# Altium schematic sheet Sheet2.SchDoc
size A4
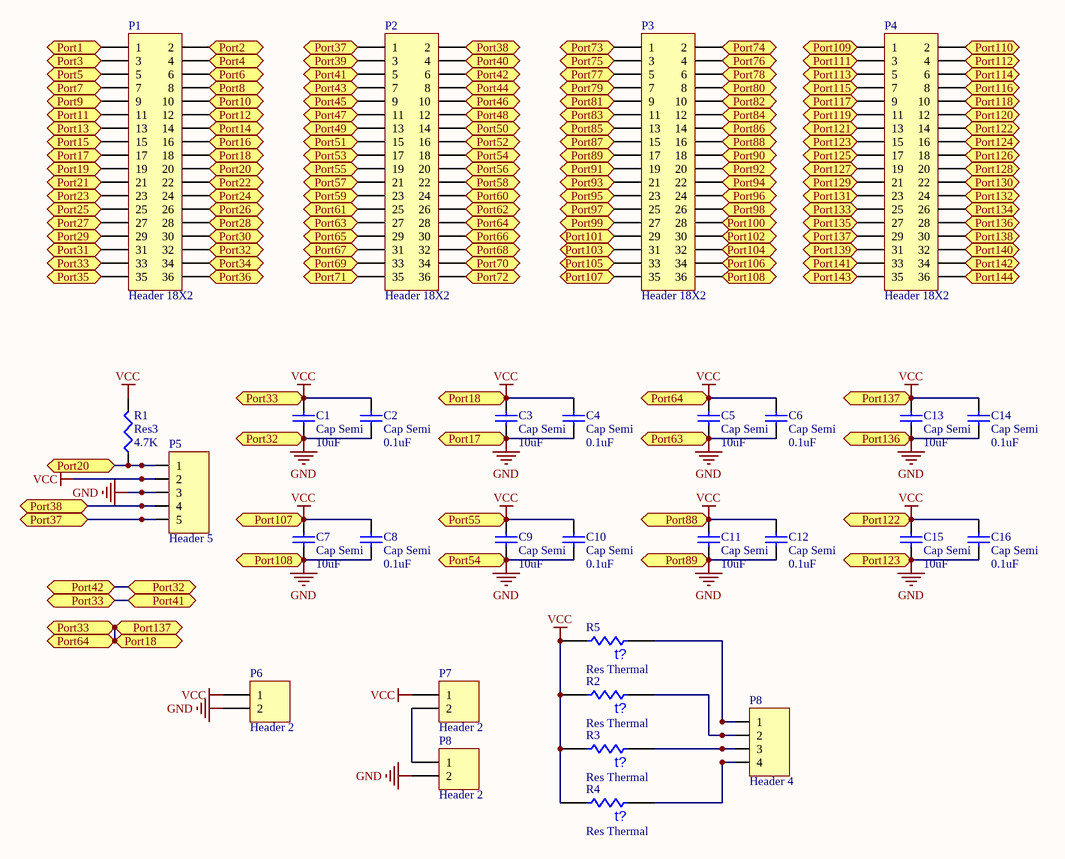
[diagram p0: Sheet2.SchDoc]

## Parts
(Parts that share a designator on the sheet are numbered #1, #2 ... from top to bottom, then left to right.)
C1  Cap Semi  value 10uF  [1608[0603]]
C2  Cap Semi  value 0.1uF  [1608[0603]]
C3  Cap Semi  value 10uF  [1608[0603]]
C4  Cap Semi  value 0.1uF  [1608[0603]]
C5  Cap Semi  value 10uF  [1608[0603]]
C6  Cap Semi  value 0.1uF  [1608[0603]]
C7  Cap Semi  value 10uF  [1608[0603]]
C8  Cap Semi  value 0.1uF  [1608[0603]]
C9  Cap Semi  value 10uF  [1608[0603]]
C10  Cap Semi  value 0.1uF  [1608[0603]]
C11  Cap Semi  value 10uF  [1608[0603]]
C12  Cap Semi  value 0.1uF  [1608[0603]]
C13  Cap Semi  value 10uF  [1608[0603]]
C14  Cap Semi  value 0.1uF  [1608[0603]]
C15  Cap Semi  value 10uF  [1608[0603]]
C16  Cap Semi  value 0.1uF  [1608[0603]]
P1  Header 18X2  [HDR2X18]
P2  Header 18X2  [HDR2X18]
P3  Header 18X2  [HDR2X18]
P4  Header 18X2  [HDR2X18]
P5  Header 5  [HDR1X5]
P6  Header 2  [HDR1X2]
P7  Header 2  [HDR1X2]
P8#1  Header 4  [HDR1X4]
P8#2  Header 2  [HDR1X2]
R1  Res3  value 4.7K  [J1-0603]
R2  Res Thermal  [6-0805_N]
R3  Res Thermal  [6-0805_N]
R4  Res Thermal  [6-0805_N]
R5  Res Thermal  [6-0805_N]

## Ports
Port1, Port2, Port3, Port4, Port5, Port6, Port7, Port8, Port9, Port10, Port11, Port12, Port13, Port14, Port15, Port16, Port17, Port18, Port19, Port20, Port21, Port22, Port23, Port24, Port25, Port26, Port27, Port28, Port29, Port30, Port31, Port32, Port33, Port34, Port35, Port36, Port37, Port38, Port39, Port40, Port41, Port42, Port43, Port44, Port45, Port46, Port47, Port48, Port49, Port50, Port51, Port52, Port53, Port54, Port55, Port56, Port57, Port58, Port59, Port60, Port61, Port62, Port63, Port64, Port65, Port66, Port67, Port68, Port69, Port70, Port71, Port72, Port73, Port74, Port75, Port76, Port77, Port78, Port79, Port80, Port81, Port82, Port83, Port84, Port85, Port86, Port87, Port88, Port89, Port90, Port91, Port92, Port93, Port94, Port95, Port96, Port97, Port98, Port99, Port100, Port101, Port102, Port103, Port104, Port105, Port106, Port107, Port108, Port109, Port110, Port111, Port112, Port113, Port114, Port115, Port116, Port117, Port118, Port119, Port120, Port121, Port122, Port123, Port124, Port125, Port126, Port127, Port128, Port129, Port130, Port131, Port132, Port133, Port134, Port135, Port136, Port137, Port138, Port139, Port140, Port141, Port142, Port143, Port144

## Nets
GND: C1.1 C2.1 C3.1 C4.1 C5.1 C6.1 C7.1 C8.1 C9.1 C10.1 C11.1 C12.1 C13.1 C14.1 C15.1 C16.1 P1.17 P1.32 P2.6 P2.18 P2.27 P3.17 P3.36 P4.15 P4.28 P5.3 P6.2 P8#2.2 ; port Port17, port Port32, port Port42, port Port54, port Port63, port Port89, port Port108, port Port123, port Port136
VCC: C1.2 C2.2 C3.2 C4.2 C5.2 C6.2 C7.2 C8.2 C9.2 C10.2 C11.2 C12.2 C13.2 C14.2 C15.2 C16.2 P1.18 P1.33 P2.5 P2.19 P2.28 P3.16 P3.35 P4.14 P4.29 P5.2 P6.1 P7.1 R1.2 R2.2 R3.2 R4.2 R5.2 ; port Port18, port Port33, port Port41, port Port55, port Port64, port Port88, port Port107, port Port122, port Port137
Port1: P1.1 ; port Port1
Port2: P1.2 ; port Port2
Port3: P1.3 ; port Port3
Port4: P1.4 ; port Port4
Port5: P1.5 ; port Port5
Port6: P1.6 ; port Port6
Port7: P1.7 ; port Port7
Port8: P1.8 ; port Port8
Port9: P1.9 ; port Port9
Port10: P1.10 ; port Port10
Port11: P1.11 ; port Port11
Port12: P1.12 ; port Port12
Port13: P1.13 ; port Port13
Port14: P1.14 ; port Port14
Port15: P1.15 ; port Port15
Port16: P1.16 ; port Port16
Port19: P1.19 ; port Port19
Port20: P1.20 P5.1 R1.1 ; port Port20
Port21: P1.21 ; port Port21
Port22: P1.22 ; port Port22
Port23: P1.23 ; port Port23
Port24: P1.24 ; port Port24
Port25: P1.25 ; port Port25
Port26: P1.26 ; port Port26
Port27: P1.27 ; port Port27
Port28: P1.28 ; port Port28
Port29: P1.29 ; port Port29
Port30: P1.30 ; port Port30
Port31: P1.31 ; port Port31
Port34: P1.34 ; port Port34
Port35: P1.35 ; port Port35
Port36: P1.36 ; port Port36
Port37: P2.1 P5.5 ; port Port37
Port38: P2.2 P5.4 ; port Port38
Port39: P2.3 ; port Port39
Port40: P2.4 ; port Port40
Port43: P2.7 ; port Port43
Port44: P2.8 ; port Port44
Port45: P2.9 ; port Port45
Port46: P2.10 ; port Port46
Port47: P2.11 ; port Port47
Port48: P2.12 ; port Port48
Port49: P2.13 ; port Port49
Port50: P2.14 ; port Port50
Port51: P2.15 ; port Port51
Port52: P2.16 ; port Port52
Port53: P2.17 ; port Port53
Port56: P2.20 ; port Port56
Port57: P2.21 ; port Port57
Port58: P2.22 ; port Port58
Port59: P2.23 ; port Port59
Port60: P2.24 ; port Port60
Port61: P2.25 ; port Port61
Port62: P2.26 ; port Port62
Port65: P2.29 ; port Port65
Port66: P2.30 ; port Port66
Port67: P2.31 ; port Port67
Port68: P2.32 ; port Port68
Port69: P2.33 ; port Port69
Port70: P2.34 ; port Port70
Port71: P2.35 ; port Port71
Port72: P2.36 ; port Port72
Port73: P3.1 ; port Port73
Port74: P3.2 ; port Port74
Port75: P3.3 ; port Port75
Port76: P3.4 ; port Port76
Port77: P3.5 ; port Port77
Port78: P3.6 ; port Port78
Port79: P3.7 ; port Port79
Port80: P3.8 ; port Port80
Port81: P3.9 ; port Port81
Port82: P3.10 ; port Port82
Port83: P3.11 ; port Port83
Port84: P3.12 ; port Port84
Port85: P3.13 ; port Port85
Port86: P3.14 ; port Port86
Port87: P3.15 ; port Port87
Port90: P3.18 ; port Port90
Port91: P3.19 ; port Port91
Port92: P3.20 ; port Port92
Port93: P3.21 ; port Port93
Port94: P3.22 ; port Port94
Port95: P3.23 ; port Port95
Port96: P3.24 ; port Port96
Port97: P3.25 ; port Port97
Port98: P3.26 ; port Port98
Port99: P3.27 ; port Port99
Port100: P3.28 ; port Port100
Port101: P3.29 ; port Port101
Port102: P3.30 ; port Port102
Port103: P3.31 ; port Port103
Port104: P3.32 ; port Port104
Port105: P3.33 ; port Port105
Port106: P3.34 ; port Port106
Port109: P4.1 ; port Port109
Port110: P4.2 ; port Port110
Port111: P4.3 ; port Port111
Port112: P4.4 ; port Port112
Port113: P4.5 ; port Port113
Port114: P4.6 ; port Port114
Port115: P4.7 ; port Port115
Port116: P4.8 ; port Port116
Port117: P4.9 ; port Port117
Port118: P4.10 ; port Port118
Port119: P4.11 ; port Port119
Port120: P4.12 ; port Port120
Port121: P4.13 ; port Port121
Port124: P4.16 ; port Port124
Port125: P4.17 ; port Port125
Port126: P4.18 ; port Port126
Port127: P4.19 ; port Port127
Port128: P4.20 ; port Port128
Port129: P4.21 ; port Port129
Port130: P4.22 ; port Port130
Port131: P4.23 ; port Port131
Port132: P4.24 ; port Port132
Port133: P4.25 ; port Port133
Port134: P4.26 ; port Port134
Port135: P4.27 ; port Port135
Port138: P4.30 ; port Port138
Port139: P4.31 ; port Port139
Port140: P4.32 ; port Port140
Port141: P4.33 ; port Port141
Port142: P4.34 ; port Port142
Port143: P4.35 ; port Port143
Port144: P4.36 ; port Port144
NetP7_2: P7.2 P8#2.1
NetP8#1_1: P8#1.1 R5.1
NetP8#1_2: P8#1.2 R2.1
NetP8#1_3: P8#1.3 R3.1
NetP8#1_4: P8#1.4 R4.1

## Notes on the sheet
- (in symbol Res Thermal) t?

## Library data of the parts
C1-C16 = Cap Semi: Capacitor (Semiconductor SIM Model); Published: 8-Jun-2000; LatestRevisionDate: 29-May-2009; LatestRevisionNote: IPC-7351 Footprint Added.; PackageReference: C1206; Publisher: Altium Limited; PackageDescription: Chip Capacitor
P1-P4 = Header 18X2: Header, 18-Pin, Dual row; LatestRevisionDate: 17-Jul-2002; LatestRevisionNote: Re-released for DXP Platform.; Publisher: Altium Limited
P5 = Header 5: Header, 5-Pin; LatestRevisionDate: 17-Jul-2002; LatestRevisionNote: Re-released for DXP Platform.; Publisher: Altium Limited
P6 P7 P8#2 = Header 2: Header, 2-Pin; LatestRevisionDate: 17-Jul-2002; LatestRevisionNote: Re-released for DXP Platform.; Publisher: Altium Limited
P8#1 = Header 4: Header, 4-Pin; LatestRevisionDate: 17-Jul-2002; LatestRevisionNote: Re-released for DXP Platform.; Publisher: Altium Limited
R1 = Res3: Resistor; Published: 8-Jun-2000; LatestRevisionDate: 29-May-2009; LatestRevisionNote: IPC-7351 Footprint Added.; PackageReference: J1-0603; Publisher: Altium Limited; PackageDescription: Chip Resistor
R2-R5 = Res Thermal: Thermistor; Published: 24-Mar-1999; LatestRevisionDate: 29-May-2009; LatestRevisionNote: IPC-7351 Footprint Added.; PackageVersion: Mar-2003; PackageReference: 6-0805; Publisher: Altium Limited; PackageDescription: Chip Resistor 0805 Case Size; Code_IPC: RESC2012